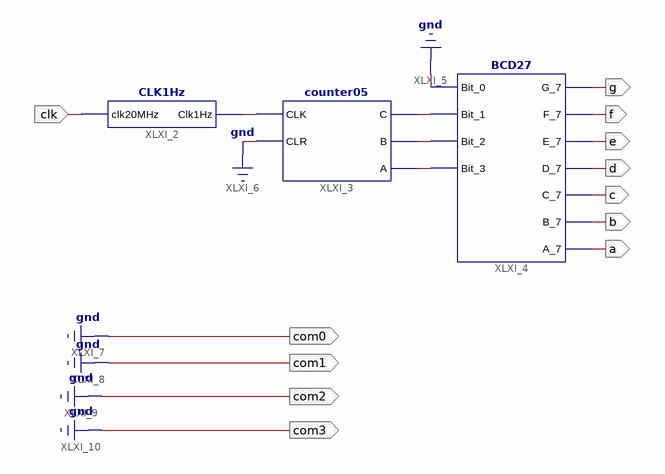
[diagram p0: schematic sheet 1]
// Xilinx ISE schematic clock.sch (spartan6) as structural Verilog: 3 symbols, 12 ports
module clock (
  input  clk,
  output g,
  output f,
  output e,
  output d,
  output c,
  output b,
  output a,
  output com0,
  output com3,
  output com2,
  output com1
);

  wire XLXN_2, XLXN_3, XLXN_4, XLXN_5;

  CLK1Hz XLXI_2 (.Clk1Hz(XLXN_2), .clk20MHz(clk));
  counter05 XLXI_3 (.A(XLXN_5), .B(XLXN_4), .C(XLXN_3), .CLK(XLXN_2), .CLR(1'b0));
  BCD27 XLXI_4 (
    .Bit_0(1'b0), .Bit_1(XLXN_3), .Bit_2(XLXN_4), .Bit_3(XLXN_5), .G_7(g), .F_7(f), .E_7(e), .D_7(d),
    .C_7(c), .B_7(b), .A_7(a));

  assign com0 = 1'b0;
  assign com1 = 1'b0;
  assign com2 = 1'b0;
  assign com3 = 1'b0;
endmodule
